# Altium project Kocka_BDD.PrjPcb
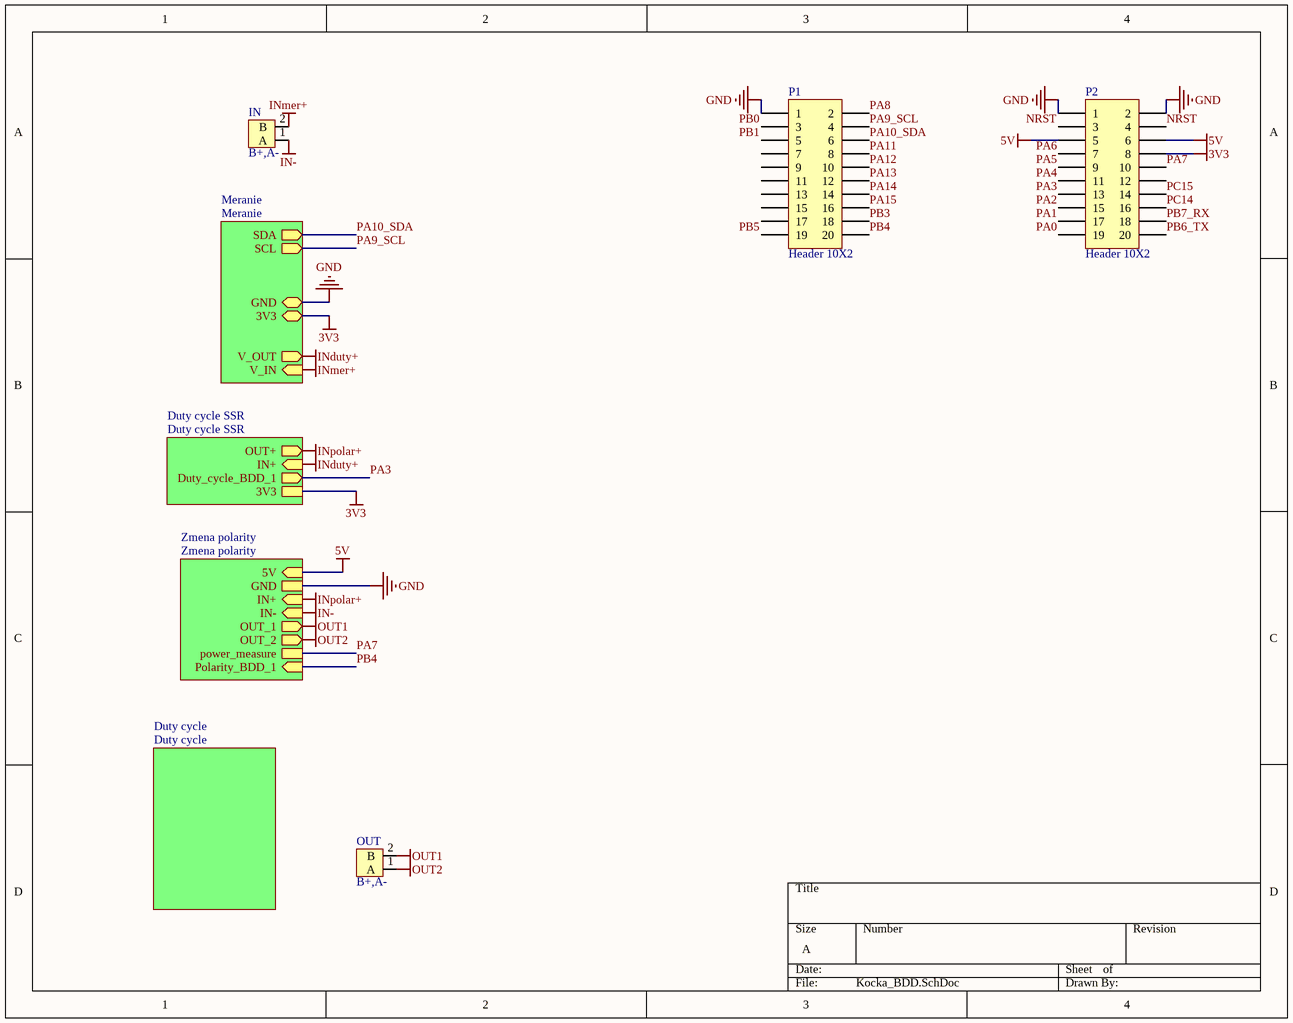
[diagram p0: Kocka_BDD.SchDoc]
5 sheets, 24 parts. Net scope: hierarchical (ports join the sheet entries above them; power ports are global).
Board files: Kocka_BDD.PcbDoc, Kocka_BDD_panel.PcbDoc
Sheets:
  Kocka_BDD.SchDoc
    Zmena polarity = Zmena polarity.SchDoc
    Duty cycle = Duty cycle.SchDoc
    Duty cycle SSR = Duty cycle SSR.SchDoc
    Meranie = Meranie.SchDoc

## Sheet Kocka_BDD.SchDoc
size A

### Parts
IN  B+,A-  [CON_2CH_PLUG]
OUT  B+,A-  [CON_2CH_PLUG]
P1  Header 10X2  [HDR2X10]
P2  Header 10X2  [HDR2X10]

### Sub-sheets
Duty cycle = Duty cycle: no entries
Duty cycle SSR = Duty cycle SSR: OUT+ (out), IN+ (in), Duty_cycle_BDD_1 (out), 3V3
Meranie = Meranie: SDA (out), SCL (out), GND (bidir), 3V3 (bidir), V_OUT (out), V_IN (in)
Zmena polarity = Zmena polarity: Polarity_BDD_1 (in), IN+ (in), 5V (in), IN- (in), GND, OUT_1 (out), power_measure, OUT_2 (out)

### Nets
3V3: P2.8 ; sheet Duty cycle SSR/3V3, sheet Meranie/3V3
5V: P2.5 P2.6 ; sheet Zmena polarity/5V
GND: P1.1 P2.1 P2.2 ; sheet Zmena polarity/GND, sheet Meranie/GND
IN-: IN.1(A) ; sheet Zmena polarity/IN-  [project net IN-_BDD_1]
INduty+: sheet Duty cycle SSR/IN+, sheet Meranie/V_OUT  [project net BDD1_INA_-]
INmer+: IN.2(B) ; sheet Meranie/V_IN  [project net BDD1_INA_+]
INpolar+: sheet Zmena polarity/IN+, sheet Duty cycle SSR/OUT+  [project net IN+_BDD_1]
OUT1: OUT.2(B) ; sheet Zmena polarity/OUT_1  [project net OUT_1_BDD_1]
OUT2: OUT.1(A) ; sheet Zmena polarity/OUT_2  [project net OUT_2_BDD_1]
NRST: P2.3 P2.4
PA0: P2.19
PA1: P2.17
PA2: P2.15
PA3: P2.13 ; sheet Duty cycle SSR/Duty_cycle_BDD_1  [project net BDD_1_DUTY_CYCLE]
PA4: P2.11
PA5: P2.9
PA6: P2.7
PA7: P2.10 ; sheet Zmena polarity/power_measure  [project net Measuring_voltage_1]
PA8: P1.2
PA9_SCL: P1.4 ; sheet Meranie/SCL
PA10_SDA: P1.6 ; sheet Meranie/SDA
PA11: P1.8
PA12: P1.10
PA13: P1.12
PA14: P1.14
PA15: P1.16
PB0: P1.3
PB1: P1.5
PB3: P1.18
PB4: P1.20 ; sheet Zmena polarity/Polarity_BDD_1
PB5: P1.19
PB6_TX: P2.20
PB7_RX: P2.18
PC14: P2.16
PC15: P2.14

Not connected (* = marked no-connect by the designer): P1 7 9 11 13 15 17; P2 12

### Library data of the parts
IN OUT = CON_2CH_PLUG: TBG-5.0-KW-2P
P1 P2 = Header 10X2: Header, 10-Pin, Dual row; LatestRevisionDate: 17-Jul-2002; LatestRevisionNote: Re-released for DXP Platform.; Publisher: Altium Limited

## Sheet Zmena polarity.SchDoc
size A
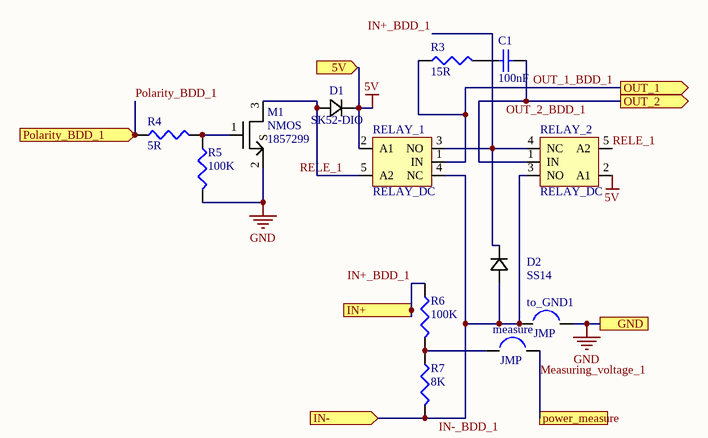
[diagram p1: Zmena polarity.SchDoc]

### Parts
C1  100nF  [1608[0603]]
D1  SK52-DIO  [D5A20V]
D2  SS14  [D5A20V]
M1  NMOS  Supplier Part Number 1: 1857299  [SOT23]
measure  JMP  [JMP]
R3  15R  [J1-0603]
R4  5R  [J1-0603]
R5  100K  [J1-0603]
R6  100K  [J1-0603]
R7  8K  [J1-0603]
RELAY_1  RELAY_DC  [RELAY_DC]
RELAY_2  RELAY_DC  [RELAY_DC]
to_GND1  JMP  [JMP]

### Ports
5V (in), GND, IN+ (in), IN- (in), OUT_1 (out), OUT_2 (out), Polarity_BDD_1 (in), power_measure

### Nets
5V: D1.1 RELAY_1.2(A1) RELAY_2.2(A1) ; port 5V
GND: M1.2(S) R5.2 to_GND1.2 ; port GND
IN+_BDD_1: D2.1 R6.1 RELAY_1.3(NO) RELAY_2.4(NC) ; port IN+
IN-_BDD_1: D2.2 R7.2 RELAY_1.4(NC) RELAY_2.3(NO) to_GND1.1 ; port IN-
OUT_1_BDD_1: R3.1 RELAY_1.1(IN) ; port OUT_1
OUT_2_BDD_1: C1.2 RELAY_2.1(IN) ; port OUT_2
Measuring_voltage_1: measure.2 ; port power_measure
Polarity_BDD_1: R4.1 ; port Polarity_BDD_1  [project net PB4]
RELE_1: D1.2 M1.3(D) RELAY_1.5(A2) RELAY_2.5(A2)
NetC1_1: C1.1 R3.2
NetM1_1: M1.1(G) R4.2 R5.1
Netmeasure_1: measure.1 R6.2 R7.1

### Library data of the parts
C1 = Cap Semi: Capacitor (Semiconductor SIM Model); Value: 100pF; Published: 8-Jun-2000; LatestRevisionDate: 29-May-2009; LatestRevisionNote: IPC-7351 Footprint Added.; PackageReference: C1206; Publisher: Altium Limited; PackageDescription: Chip Capacitor
D1 D2 = D_5A_20V
R3 = Res3: Resistor; Value: 2R; Published: 8-Jun-2000; LatestRevisionDate: 29-May-2009; LatestRevisionNote: IPC-7351 Footprint Added.; PackageReference: J1-0603; Publisher: Altium Limited; PackageDescription: Chip Resistor
R4-R7 = Res3: Resistor; Value: 200K; Published: 8-Jun-2000; LatestRevisionDate: 29-May-2009; LatestRevisionNote: IPC-7351 Footprint Added.; PackageReference: J1-0603; Publisher: Altium Limited; PackageDescription: Chip Resistor
RELAY_1 RELAY_2 = RELAY_DC: RM51-3011-85-1005
M1 = NMOS: Supplier 1: Farnell

## Sheet Duty cycle.SchDoc
size A
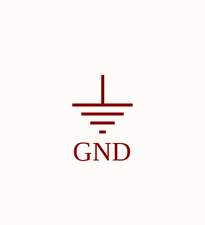
[diagram p2: Duty cycle.SchDoc]

### Notes on the sheet
- Labels drawn without touching a wire or pin: GND

## Sheet Duty cycle SSR.SchDoc
size A
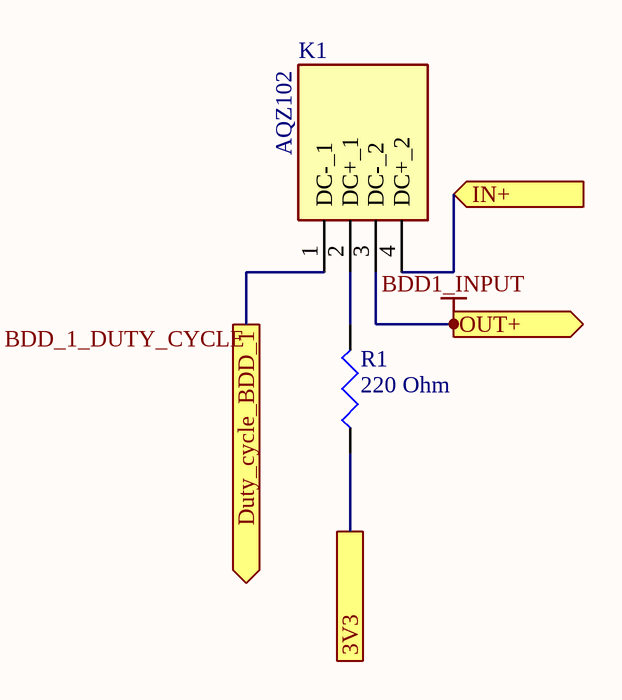
[diagram p3: Duty cycle SSR.SchDoc]

### Parts
K1  AQZ102  [AQZ102]
R1  220 Ohm  [J1-0603]

### Ports
3V3, Duty_cycle_BDD_1 (out), IN+ (in), OUT+ (out)

### Nets
3V3: R1.1 ; port 3V3
BDD1_INA_-: K1.4(DC+_2) ; port IN+
BDD1_INPUT: K1.3(DC-_2) ; port OUT+  [project net IN+_BDD_1]
BDD_1_DUTY_CYCLE: K1.1(DC-_1) ; port Duty_cycle_BDD_1
NetK1_2: K1.2(DC+_1) R1.2

### Library data of the parts
K1 = AQZ102: Relay or Contactor; Manufacturer_Name: Panasonic; Datasheet Link: https://industrial.panasonic.com/ac/cdn/e/control/relay/photomos/catalog/semi_eng_pwr1a_aqz10_20.pdf; Height: 11mm; Manufacturer_Part_Number: AQZ102; Arrow Part Number: AQZ102; Arrow Price/Stock: https://www.arrow.com/en/products/aqz102/panasonic; Mouser Part Number: 769-AQZ102; Mouser Price/Stock: https://www.mouser.co.uk/ProductDetail/Panasonic-Industrial-Devices/AQZ102?qs=tR16lFwwUU%2FVYpsj8M3w%252BA%3D%3D
R1 = Res3: Resistor; Value: 10K; Published: 8-Jun-2000; LatestRevisionDate: 29-May-2009; LatestRevisionNote: IPC-7351 Footprint Added.; PackageReference: J1-0603; Publisher: Altium Limited; PackageDescription: Chip Resistor

## Sheet Meranie.SchDoc
size A
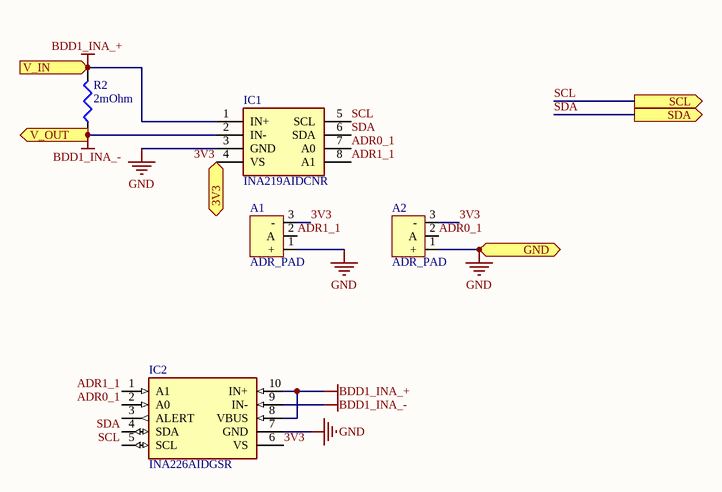
[diagram p4: Meranie.SchDoc]

### Parts
A1  ADR_PAD  [SOLDER_PAD]
A2  ADR_PAD  [SOLDER_PAD]
IC1  INA219AIDCNR  [SOT65P280X145-8N]
IC2  INA226AIDGSR  [SOP50P490X110-10N]
R2  2mOhm  [RESC3216X75N]

### Ports
3V3 (bidir), GND (bidir), SCL (out), SDA (out), V_IN (in), V_OUT (out)

### Nets
3V3: A1.3(-) A2.3(-) IC1.4(VS) IC2.6(VS) ; port 3V3
BDD1_INA_+: IC1.1(IN+) IC2.8(VBUS) IC2.10(IN+) R2.2 ; port V_IN
BDD1_INA_-: IC1.2(IN-) IC2.9(IN-) R2.1 ; port V_OUT
GND: A1.1(+) A2.1(+) IC1.3(GND) IC2.7(GND) ; port GND
ADR0_1: A2.2(A) IC1.7(A0) IC2.2(A0)
ADR1_1: A1.2(A) IC1.8(A1) IC2.1(A1)
SCL: IC1.5(SCL) IC2.5(SCL) ; port SCL  [project net PA9_SCL]
SDA: IC1.6(SDA) IC2.4(SDA) ; port SDA  [project net PA10_SDA]

Not connected (* = marked no-connect by the designer): IC2 3(ALERT)

### Library data of the parts
A1 A2 = ADR_PAD: ADR PAD 3 PIN
IC1 = INA219BIDCNR: Integrated Circuit; Manufacturer_Name: Texas Instruments; Datasheet Link: http://www.ti.com/lit/ds/symlink/ina219.pdf; Height: 1.45mm; Manufacturer_Part_Number: INA219BIDCNR; Mouser Part Number: 595-INA219BIDCNR; Mouser Price/Stock: https://www.mouser.com/Search/Refine.aspx?Keyword=595-INA219BIDCNR
IC2 = INA226AIDGSR: Integrated Circuit; Manufacturer_Name: Texas Instruments; Datasheet Link: https://componentsearchengine.com/Datasheets/1/INA226AIDGSR.pdf; Height: 1.1mm; Manufacturer_Part_Number: INA226AIDGSR; Arrow Part Number: INA226AIDGSR; Arrow Price/Stock: https://www.arrow.com/en/products/ina226aidgsr/texas-instruments; Mouser Part Number: 595-INA226AIDGSR; Mouser Price/Stock: https://www.mouser.co.uk/ProductDetail/Texas-Instruments/INA226AIDGSR?qs=tQG3bEuiOZD4quG3egR36g%3D%3D
R2 = Res3: Resistor; Published: 8-Jun-2000; LatestRevisionDate: 29-May-2009; LatestRevisionNote: IPC-7351 Footprint Added.; PackageReference: J1-0603; Publisher: Altium Limited; PackageDescription: Chip Resistor; Value: 2mOhm

## Nets that join several sheets
3V3: Kocka_BDD (P2.8), Duty cycle SSR (R1.1), Meranie (A1.3 A2.3 IC1.4 IC2.6)
5V: Kocka_BDD (P2.5 P2.6), Zmena polarity (D1.1 RELAY_1.2 RELAY_2.2)
BDD1_INA_+: Kocka_BDD (IN.2), Meranie (IC1.1 IC2.8 IC2.10 R2.2)
BDD1_INA_-: Duty cycle SSR (K1.4), Meranie (IC1.2 IC2.9 R2.1)
GND: Kocka_BDD (P1.1 P2.1 P2.2), Zmena polarity (M1.2 R5.2 to_GND1.2), Meranie (A1.1 A2.1 IC1.3 IC2.7)
IN+_BDD_1: Zmena polarity (D2.1 R6.1 RELAY_1.3 RELAY_2.4), Duty cycle SSR (K1.3)
IN-_BDD_1: Kocka_BDD (IN.1), Zmena polarity (5 pins)
OUT_1_BDD_1: Kocka_BDD (OUT.2), Zmena polarity (R3.1 RELAY_1.1)
OUT_2_BDD_1: Kocka_BDD (OUT.1), Zmena polarity (C1.2 RELAY_2.1)
BDD_1_DUTY_CYCLE: Kocka_BDD (P2.13), Duty cycle SSR (K1.1)
Measuring_voltage_1: Kocka_BDD (P2.10), Zmena polarity (measure.2)
PA9_SCL: Kocka_BDD (P1.4), Meranie (IC1.5 IC2.5)
PA10_SDA: Kocka_BDD (P1.6), Meranie (IC1.6 IC2.4)
PB4: Kocka_BDD (P1.20), Zmena polarity (R4.1)